# EAGLE design 523_jetson_jetbook (EAGLE 9.6.2)
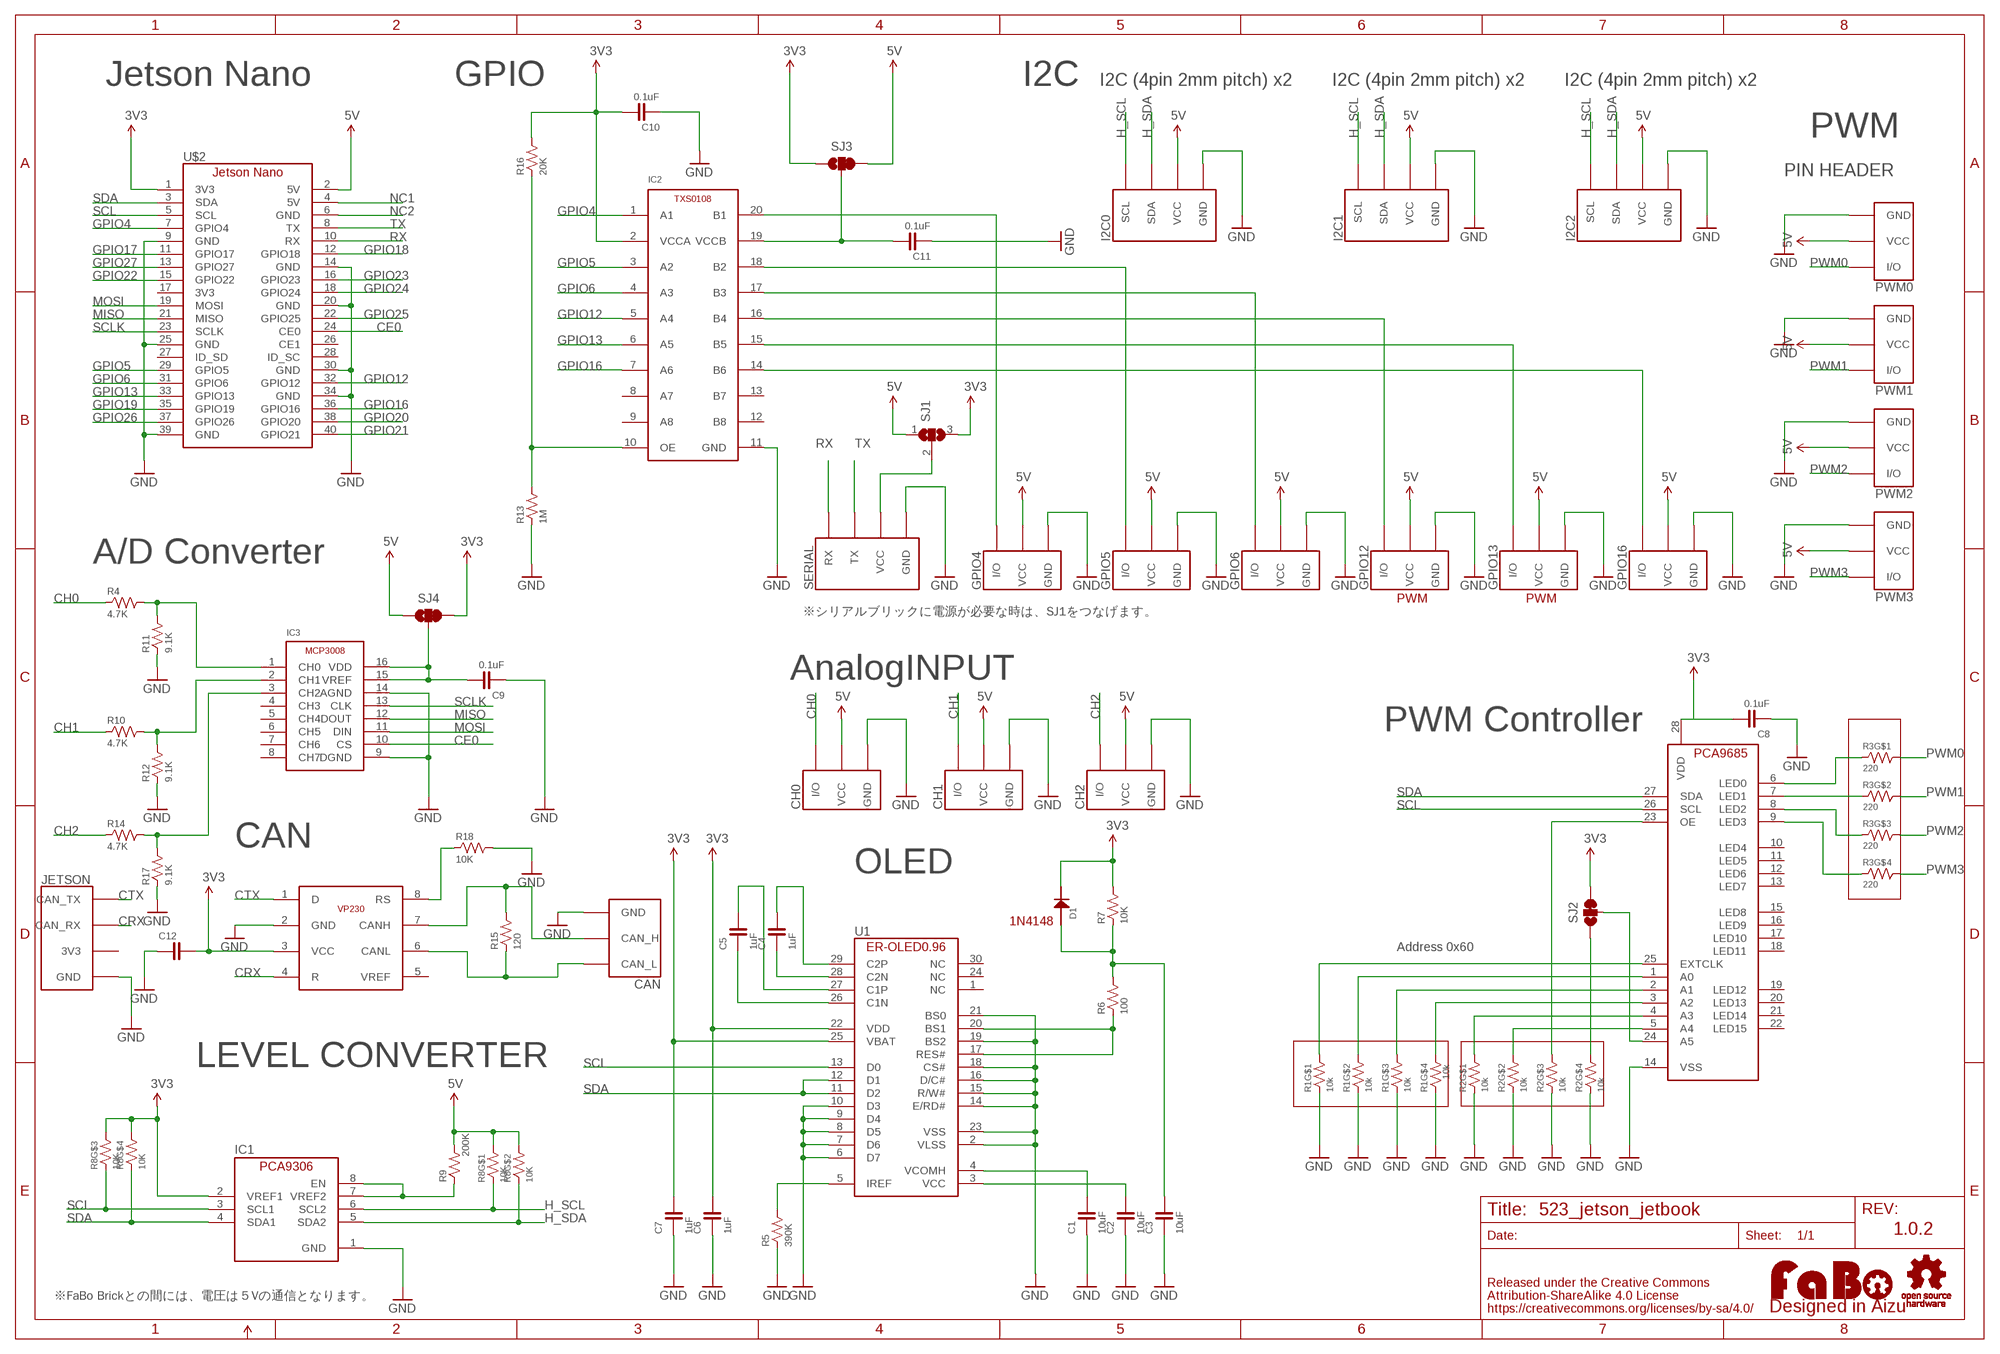
[diagram p0: schematic, sheet 1]

## Parts
C1  10uF  CAPACITOR-0603-BOTTOM  [0603-BOTTOM]
C2  10uF  CAPACITOR-0603-BOTTOM  [0603-BOTTOM]
C3  10uF  CAPACITOR-0603-BOTTOM  [0603-BOTTOM]
C4  1uF  CAPACITOR-0603-BOTTOM  [0603-BOTTOM]
C5  1uF  CAPACITOR-0603-BOTTOM  [0603-BOTTOM]
C6  1uF  CAPACITOR-0603-BOTTOM  [0603-BOTTOM]
C7  1uF  CAPACITOR-0603-BOTTOM  [0603-BOTTOM]
C8  0.1uF  CAPACITOR-0603  [0603]
C9  0.1uF  CAPACITOR-0603  [0603]
C10  0.1uF  CAPACITOR-0603  [0603]
C11  0.1uF  CAPACITOR-0603  [0603]
C12  CAPACITOR-0603  [0603]
CAN  FABO_BRICK_CAN  [FABO_BRICK_3PIN_B03B-PASK-1-CAN]
CH0  FABO_BRICK_3PIN-B03B-PASK-1  [FABO_BRICK_3PIN_B03B-PASK-1]
CH1  FABO_BRICK_3PIN-B03B-PASK-1  [FABO_BRICK_3PIN_B03B-PASK-1]
CH2  FABO_BRICK_3PIN-B03B-PASK-1  [FABO_BRICK_3PIN_B03B-PASK-1]
D1  1N4148  [1N4148W]
GPIO4  FABO_BRICK_3PIN-B03B-PASK-1  [FABO_BRICK_3PIN_B03B-PASK-1]
GPIO5  FABO_BRICK_3PIN-B03B-PASK-1  [FABO_BRICK_3PIN_B03B-PASK-1]
GPIO6  FABO_BRICK_3PIN-B03B-PASK-1  [FABO_BRICK_3PIN_B03B-PASK-1]
GPIO12  FABO_BRICK_3PIN-B03B-PASK-1  [FABO_BRICK_3PIN_B03B-PASK-1]
GPIO13  FABO_BRICK_3PIN-B03B-PASK-1  [FABO_BRICK_3PIN_B03B-PASK-1]
GPIO16  FABO_BRICK_3PIN-B03B-PASK-1  [FABO_BRICK_3PIN_B03B-PASK-1]
I2C0  FABO_BRICK_I2C-B04B-PASK-1  [FABO_BRICK_I2C_B04B-PASK-1]
I2C1  FABO_BRICK_I2C-B04B-PASK-1  [FABO_BRICK_I2C_B04B-PASK-1]
I2C2  FABO_BRICK_I2C-B04B-PASK-1  [FABO_BRICK_I2C_B04B-PASK-1]
IC1  PCA9306_SSOP  [8PIN-SSOP]
IC2  TXS0108  [R-PUSON-N20]
IC3  MICROCHIP-MCP3008  [MICROCHIP-MCP3008]
JETSON  FABO_BRICK_CAN_4P  [FABO_BRICK_CAN_B04B-PASL-1_BOTTOM]
LOGO1  LOGO_FABO-M  [LOGO_FABO_M]
PWM0  FABO_BRICK_3PIN-HEADER  [FABO_BRICK_3PIN_HEADER]
PWM1  FABO_BRICK_3PIN-HEADER  [FABO_BRICK_3PIN_HEADER]
PWM2  FABO_BRICK_3PIN-HEADER  [FABO_BRICK_3PIN_HEADER]
PWM3  FABO_BRICK_3PIN-HEADER  [FABO_BRICK_3PIN_HEADER]
R1  10k  RESISTOR_ARRAY  [EXBV8V]
R2  10k  RESISTOR_ARRAY  [EXBV8V]
R3  220  RESISTOR_ARRAY  [EXBV8V]
R4  4.7K  RESISTOR-0603-BOTTOM  [0603-BOTTOM]
R5  390K  RESISTOR-0603-BOTTOM  [0603-BOTTOM]
R6  100  RESISTOR-0603-BOTTOM  [0603-BOTTOM]
R7  10K  RESISTOR-0603-BOTTOM  [0603-BOTTOM]
R8  10K  RESISTOR_ARRAY  [EXBV8V]
R9  200K  RESISTOR-0603  [0603]
R10  4.7K  RESISTOR-0603-BOTTOM  [0603-BOTTOM]
R11  9.1K  RESISTOR-0603-BOTTOM  [0603-BOTTOM]
R12  9.1K  RESISTOR-0603-BOTTOM  [0603-BOTTOM]
R13  1M  RESISTOR-0603-BOTTOM  [0603-BOTTOM]
R14  4.7K  RESISTOR-0603-BOTTOM  [0603-BOTTOM]
R15  120  RESISTOR-0603  [0603]
R16  20K  RESISTOR-0603-BOTTOM  [0603-BOTTOM]
R17  9.1K  RESISTOR-0603-BOTTOM  [0603-BOTTOM]
R18  10K  RESISTOR-0603  [0603]
SERIAL  FABO_BRICK_SERIAL-B04B-PASK-1  [FABO_BRICK_SERIAL_B04B-PASK-1]
SJ1  SJ2W  [SJ_2]
SJ2  SMD-JUMPER-3-23SHORT  [SMD-JUMPER-3]
SJ3  SMD-JUMPER-3-23SHORT  [SMD-JUMPER-3]
SJ4  SMD-JUMPER-3-23SHORT  [SMD-JUMPER-3]
U1  ER-OLED0.96-1ER-CON30HT-1  [ER-CON30HT-1]
U$2  JETSON_NANO_NORBORDER_BOTTOM  [JETSON_NANO_NOBOARDER_BOTTOM]
U$7  LOGO_OSHW-M_BOTTOM  [LOGO_OSHW_M_BOTTOM]
U$8  SN65HVD230  [SN65HVD230]
U$9  PCA9685  [PCA9685]

## Nets
3V3: C6.2 C7.2 C8.2 C10.2 C12.2 D1.CATHODE IC1.2(VREF1) IC2.2(VCCA) R7.2 R8.5 R8.6 R16.2 SJ1.3 SJ2.3 SJ3.1 SJ4.3 U1.22(VDD) U1.25(VBAT) U$2.1(3V3) U$8.3(VCC) U$9.28(VDD)
5V: CH0.VCC CH1.VCC CH2.VCC GPIO4.VCC GPIO5.VCC GPIO6.VCC GPIO12.VCC GPIO13.VCC GPIO16.VCC I2C0.VCC I2C1.VCC I2C2.VCC PWM0.VCC PWM1.VCC PWM2.VCC PWM3.VCC R8.7 R8.8 R9.2 SJ1.1 SJ3.3 SJ4.1 U$2.2(5V)
CE0: IC3.10(CS) U$2.24(CE0)
CH0: CH0.I/O R4.1
CH1: CH1.I/O R10.1
CH2: CH2.I/O R14.1
CRX: JETSON.CAN_RX U$8.4(R)
CTX: JETSON.CAN_TX U$8.1(D)
GND: C1.1 C2.1 C3.1 C6.1 C7.1 C8.1 C9.1 C10.1 C11.1 C12.1 CAN.GND CH0.GND CH1.GND CH2.GND GPIO4.GND GPIO5.GND GPIO6.GND GPIO12.GND GPIO13.GND GPIO16.GND I2C0.GND I2C1.GND I2C2.GND IC1.1(GND) IC2.11(GND) IC3.9(DGND) IC3.14(AGND) JETSON.GND PWM0.GND PWM1.GND PWM2.GND PWM3.GND R1.1 R1.2 R1.3 R1.4 R2.1 R2.2 R2.3 R2.4 R5.1 R11.1 R12.1 R13.1 R17.1 R18.2 SERIAL.GND U1.2(VLSS) U1.6(D7) U1.7(D6) U1.8(D5) U1.9(D4) U1.10(D3) U1.14(E/RD#) U1.15(R/W#) U1.16(D/C#) U1.18(CS#) U1.19(BS2) U1.21(BS0) U1.23(VSS) U$2.9(GND) U$2.14(GND) U$2.20(GND) U$2.25(GND) U$2.30(GND) U$2.34(GND) U$2.39(GND) U$8.2(GND) U$9.14(VSS)
GPIO4: IC2.1(A1) U$2.7(GPIO4)
GPIO5: IC2.3(A2) U$2.29(GPIO5)
GPIO6: IC2.4(A3) U$2.31(GPIO6)
GPIO12: IC2.5(A4) U$2.32(GPIO12)
GPIO13: IC2.6(A5) U$2.33(GPIO13)
GPIO16: IC2.7(A6) U$2.36(GPIO16)
GPIO17: U$2.11(GPIO17)
GPIO18: U$2.12(GPIO18)
GPIO19: U$2.35(GPIO19)
GPIO20: U$2.38(GPIO20)
GPIO21: U$2.40(GPIO21)
GPIO22: U$2.15(GPIO22)
GPIO23: U$2.16(GPIO23)
GPIO24: U$2.18(GPIO24)
GPIO25: U$2.22(GPIO25)
GPIO26: U$2.37(GPIO26)
GPIO27: U$2.13(GPIO27)
H_SCL: I2C0.SCL I2C1.SCL I2C2.SCL IC1.6(SCL2) R8.1
H_SDA: I2C0.SDA I2C1.SDA I2C2.SDA IC1.5(SDA2) R8.2
MISO: IC3.12(DOUT) U$2.21(MISO)
MOSI: IC3.11(DIN) U$2.19(MOSI)
N$2: R3.1 U$9.6(LED0)
N$3: R3.2 U$9.7(LED1)
N$4: R1.7 U$9.1(A0)
N$5: R3.3 U$9.8(LED2)
N$6: R3.4 U$9.9(LED3)
N$7: R2.6 U$9.23(OE)
N$8: R1.8 U$9.25(EXTCLK)
N$9: GPIO4.I/O IC2.20(B1)
N$10: R1.6 U$9.2(A1)
N$11: R1.5 U$9.3(A2)
N$12: R2.8 U$9.4(A3)
N$13: R2.7 U$9.5(A4)
N$14: C5.2 U1.27(C1P)
N$15: GPIO5.I/O IC2.18(B2)
N$16: C5.1 U1.26(C1N)
N$17: GPIO6.I/O IC2.17(B3)
N$18: GPIO12.I/O IC2.16(B4)
N$19: C4.1 U1.28(C2N)
N$20: GPIO13.I/O IC2.15(B5)
N$21: C4.2 U1.29(C2P)
N$22: GPIO16.I/O IC2.14(B6)
N$23: R5.2 U1.5(IREF)
N$24: C1.2 U1.4(VCOMH)
N$25: C2.2 U1.3(VCC)
N$26: R6.1 U1.17(RES#) U1.20(BS1)
N$27: C3.2 D1.ANODE R6.2 R7.1
N$28: IC2.10(OE) R13.2 R16.1
N$29: C11.2 IC2.19(VCCB) SJ3.2
N$30: SERIAL.VCC SJ1.2
N$31: IC3.3(CH2) R14.2 R17.2
N$32: SJ2.2 U$9.24(A5)
N$33: IC1.7(VREF2) IC1.8(EN) R9.1
N$34: IC3.1(CH0) R4.2 R11.2
N$35: R2.5 SJ2.1
N$36: IC3.2(CH1) R10.2 R12.2
N$37: C9.2 IC3.15(VREF) IC3.16(VDD) SJ4.2
N$38: CAN.CAN_H R15.2 U$8.7(CANH)
N$39: CAN.CAN_L R15.1 U$8.6(CANL)
N$40: R18.1 U$8.8(RS)
NC1: U$2.4(5V)
NC2: U$2.6(GND)
PWM0: PWM0.I/O R3.8
PWM1: PWM1.I/O R3.7
PWM2: PWM2.I/O R3.6
PWM3: PWM3.I/O R3.5
RX: SERIAL.RX U$2.10(RX)
SCL: IC1.3(SCL1) R8.3 U1.13(D0) U$2.5(SCL) U$9.26(SCL)
SCLK: IC3.13(CLK) U$2.23(SCLK)
SDA: IC1.4(SDA1) R8.4 U1.11(D2) U1.12(D1) U$2.3(SDA) U$9.27(SDA)
TX: SERIAL.TX U$2.8(TX)
Unconnected: IC2.8(A7) IC2.9(A8) IC2.12(B8) IC2.13(B7) IC3.4(CH3) IC3.5(CH4) IC3.6(CH5) IC3.7(CH6) IC3.8(CH7) JETSON.VCC(3V3) U1.1(NC) U1.24(NC) U1.30(NC) U$2.17(3V3) U$2.26(CE1) U$2.27(ID_SD) U$2.28(ID_SC) U$8.5(VREF) U$9.10(LED4) U$9.11(LED5) U$9.12(LED6) U$9.13(LED7) U$9.15(LED8) U$9.16(LED9) U$9.17(LED10) U$9.18(LED11) U$9.19(LED12) U$9.20(LED13) U$9.21(LED14) U$9.22(LED15)

## Notes on the sheet
- Jetson Nano | GPIO | I2C | I2C (4pin 2mm pitch) x2 | I2C (4pin 2mm pitch) x2 | I2C (4pin 2mm pitch) x2
- PWM
- PIN HEADER
- A/D Converter
- PWM | PWM
- ※シリアルブリックに電源が必要な時は、SJ1をつなげます。
- AnalogINPUT
- PWM Controller
- CAN
- OLED
- 1N4148
- Address 0x60
- LEVEL CONVERTER
- 1.0.2
- ※FaBo Brickとの間には、電圧は５Vの通信となります。

## Library data of the parts
C1-C12 = FaBo-Capacitor:CAPACITOR: CAPACITOR
CAN = FaBo-Template:FABO_BRICK_CAN
CH0 CH1 CH2 GPIO4-GPIO6 GPIO12 GPIO13 GPIO16 PWM0 PWM1-PWM3 = FaBo-Template:FABO_BRICK_3PIN: FaBo Brick 3pin
D1 = FaBo-Diode:1N4148
I2C0 I2C1 I2C2 = FaBo-Template:FABO_BRICK_I2C: FaBo Brick I2C
IC1 = FaBo-LevelTranslator:PCA9306
IC2 = FaBo-LevelTranslator:TXS0108
IC3 = FaBo-ADC:MICROCHIP-MCP3008
JETSON = FaBo-Template:FABO_BRICK_CAN_4P
LOGO1 = component:LOGO_FABO
R1-R3 R8 = component:RESISTOR_ARRAY
R4-R7 R9-R18 = FaBo-Resistors:RESISTOR: RESISTOR
SERIAL = FaBo-Template:FABO_BRICK_SERIAL: FaBo Brick Serial
SJ1 = jumper:SJ2W: SMD solder JUMPER
SJ2-SJ4 = FaBo-etc:SMD-JUMPER-3-23SHORT
U1 = FaBo-Display:ER-OLED0.96-1
U$2 = FaBo-Boards:JETSON_NANO
U$7 = component:LOGO_OSHW
U$8 = FaBo-CAN:SN65HVD230
U$9 = FaBo-Motor:PCA9685

## Board
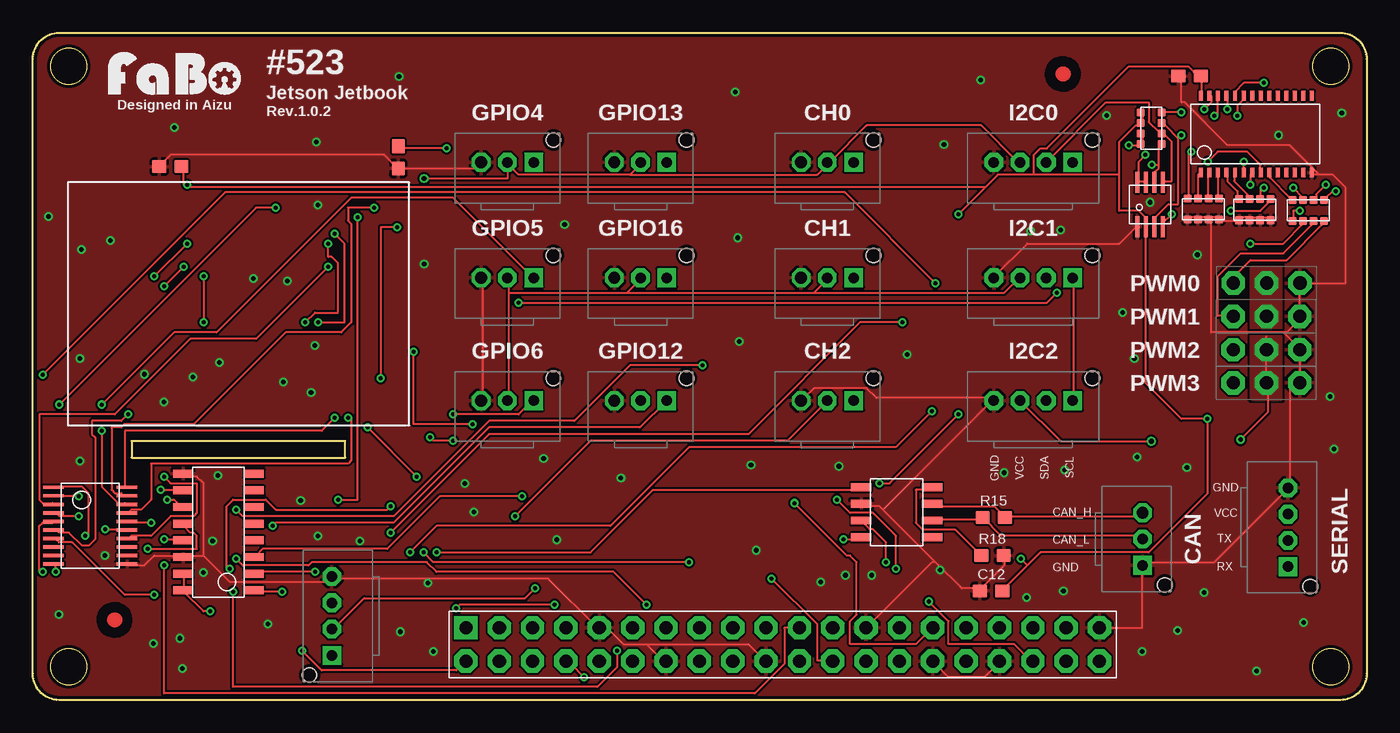
[diagram p1: board, top side]
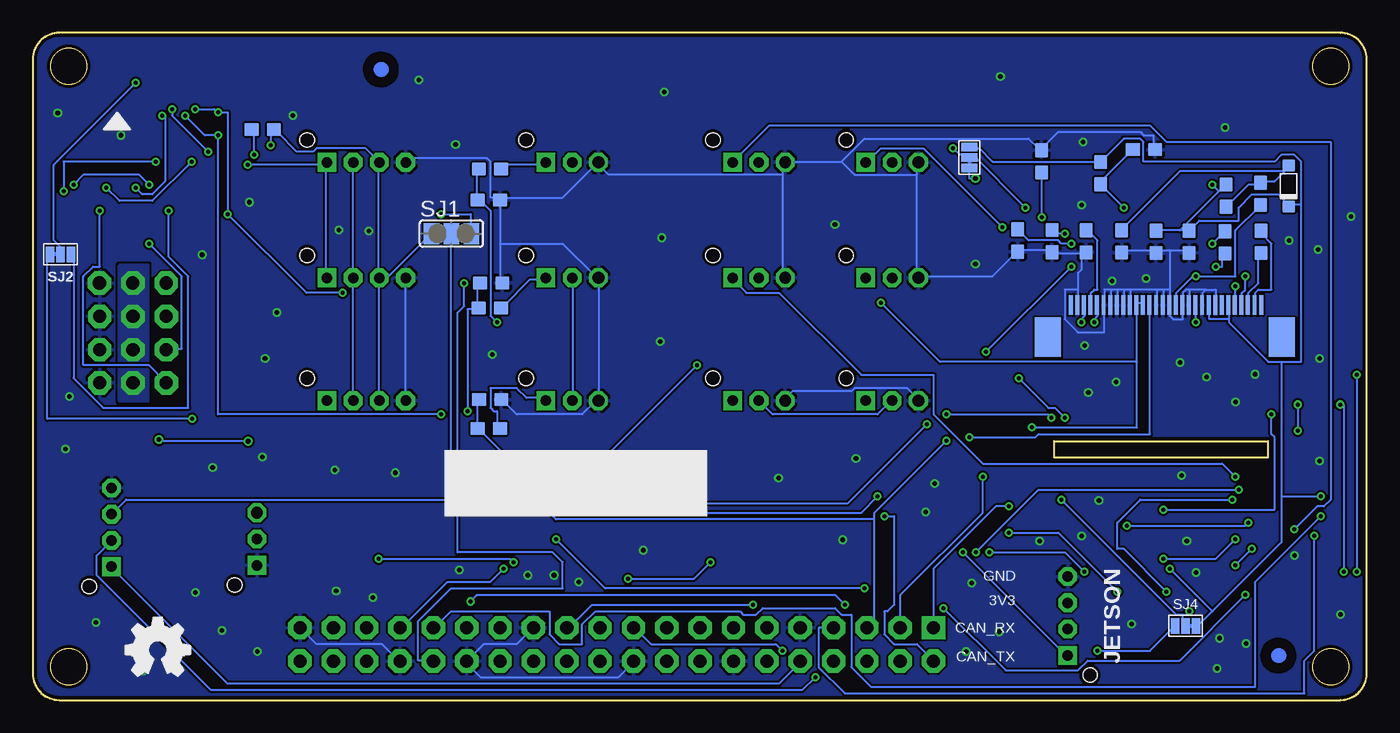
[diagram p2: board, bottom side, seen from below]

Size 101.6 x 50.8 mm. Coordinates in mm from the lower left corner, seen from the top.
Outline: 7.52,18.45 23.8,18.45 23.8,19.72 7.52,19.72 7.52,18.45
Outline: 101.6,48.8 101.6,2 arc-90 99.6,0 2,0 arc-90 0,2 0,48.8 arc-90 2,50.8 99.6,50.8 arc-90 101.6,48.8
Outline: circle at 2.75,48.26 radius 1.38
Outline: circle at 2.75,2.54 radius 1.38
Outline: circle at 98.85,2.54 radius 1.38
Outline: circle at 98.85,48.26 radius 1.38
Copper layers (1*16): Top 0.035mm / dielectric 1.6mm / Bottom 0.035mm
Design rules "PCBway": minimum track width 6mil, minimum drill 12mil, track to track 6mil, track to pad 6mil, pad to pad 6mil, via to via 6mil, smd to smd 6mil, copper to edge 10mil, drill to drill 10mil, minimum pad ring 10mil, minimum via ring 6mil, stop-mask expansion 2mil, vias tented up to drill 100mil, thermal gap 8mil
bRestrict: 7 lines

### Footprints (pad centres in the part's own frame; a part is rotated, then mirrored left to right if it is on the bottom)
0603-BOTTOM = smd 1.1 x 1 bottom: 1 -0.85,0; 2 0.85,0
0603 = smd 1.1 x 1: 1 -0.85,0; 2 0.85,0
FABO_BRICK_3PIN_B03B-PASK-1-CAN = drill 0.9 pad 1.422 octagon: CAN_H -2,0 | drill 0.8 pad 1.422 octagon: CAN_L 0,0 | drill 0.8 pad 1.422 square: GND 2,0 | hole 1.1: 3.5,1.7
FABO_BRICK_3PIN_B03B-PASK-1 = drill 0.9 pad 1.422 octagon: GND -2,0 | drill 0.8 pad 1.422 square: I/O 2,0 | drill 0.8 pad 1.422 octagon: VCC 0,0 | hole 1.1: 3.5,1.7
1N4148W = smd 0.9 x 0.95: ANODE 0,0; CATHODE 3.15,0
FABO_BRICK_I2C_B04B-PASK-1 = drill 0.8 pad 1.422 octagon: GND -3,0; SDA 1,0; VCC -1,0 | drill 0.8 pad 1.422 square: SCL 3,0 | hole 1.1: 4.5,1.7
8PIN-SSOP = smd 0.3 x 1.6: 1 -0.975,-1.7; 2 -0.325,-1.7; 3 0.325,-1.7; 4 0.975,-1.7; 5 0.975,1.7; 6 0.325,1.7; 7 -0.325,1.7; 8 -0.975,1.7
R-PUSON-N20 = smd 0.25 x 1.55: 1 -2.925,-2.8; 2 -2.275,-2.8; 3 -1.625,-2.8; 4 -0.975,-2.8; 5 -0.325,-2.8; 6 0.325,-2.8; 7 0.975,-2.8; 8 1.625,-2.8; 9 2.275,-2.8; 10 2.925,-2.8; 11 2.925,2.8; 12 2.275,2.8; 13 1.625,2.8; 14 0.975,2.8; 15 0.325,2.8; 16 -0.325,2.8; 17 -0.975,2.8; 18 -1.625,2.8; 19 -2.275,2.8; 20 -2.925,2.8
MICROCHIP-MCP3008 = smd 0.6 x 1.5: 1 -4.445,-2.7; 2 -3.175,-2.7; 3 -1.905,-2.7; 4 -0.635,-2.7; 5 0.635,-2.7; 6 1.905,-2.7; 7 3.175,-2.7; 8 4.445,-2.7; 9 4.445,2.7; 10 3.175,2.7; 11 1.905,2.7; 12 0.635,2.7; 13 -0.635,2.7; 14 -1.905,2.7; 15 -3.175,2.7; 16 -4.445,2.7
FABO_BRICK_CAN_B04B-PASL-1_BOTTOM = drill 0.8 pad 1.422 octagon: CAN_RX -1,0.025; GND 3,0.025; VCC 1,0.025 | drill 0.8 pad 1.422 square: CAN_TX -3,0.025 | hole 1.1: -4.5,1.725
FABO_BRICK_3PIN_HEADER = drill 1 pad 1.778 octagon: GND -2.54,0; I/O 2.54,0; VCC 0,0
EXBV8V = smd 0.6 x 0.6: 1 -1.2,-0.8; 2 -0.4,-0.8; 3 0.4,-0.8; 4 1.2,-0.8; 5 1.2,0.8; 6 0.4,0.8; 7 -0.4,0.8; 8 -1.2,0.8
FABO_BRICK_SERIAL_B04B-PASK-1 = drill 0.8 pad 1.422 octagon: GND -3,0; TX 1,0; VCC -1,0 | drill 0.8 pad 1.422 square: RX 3,0 | hole 1.1: 4.5,1.7
SJ_2 = smd 1.168 x 1.6: 1 -1.524,0; 2 0,0; 3 1.524,0
SMD-JUMPER-3 = smd 0.64 x 1.2: 1 -0.8,0; 2 0,0; 3 0.8,0
ER-CON30HT-1 = smd 0.3 x 1.5 bottom: 1 7,-0.23; 2 6.5,-0.23; 3 6,-0.23; 4 5.5,-0.23; 5 5,-0.23; 6 4.5,-0.23; 7 4,-0.23; 8 3.5,-0.23; 9 3,-0.23; 10 2.5,-0.23; 11 2,-0.23; 12 1.5,-0.23; 13 1,-0.23; 14 0.5,-0.23; 15 0,-0.23; 16 -0.5,-0.23; 17 -1,-0.23; 18 -1.5,-0.23; 19 -2,-0.23; 20 -2.5,-0.23; 21 -3,-0.23; 22 -3.5,-0.23; 23 -4,-0.23; 24 -4.5,-0.23; 25 -5,-0.23; 26 -5.5,-0.23; 27 -6,-0.23; 28 -6.5,-0.23; 29 -7,-0.23; 30 -7.5,-0.23 | smd 2 x 3 bottom: 31 -9.07,-2.67; 32 8.74,-2.67
JETSON_NANO_NOBOARDER_BOTTOM = drill 1 pad 1.778 square: 1 -25.4,1.27 | drill 1 pad 1.778 octagon: 2 -25.4,-1.27; 3 -22.86,1.27; 4 -22.86,-1.27; 5 -20.32,1.27; 6 -20.32,-1.27; 7 -17.78,1.27; 8 -17.78,-1.27; 9 -15.24,1.27; 10 -15.24,-1.27; 11 -12.7,1.27; 12 -12.7,-1.27; 13 -10.16,1.27; 14 -10.16,-1.27; 15 -7.62,1.27; 16 -7.62,-1.27; 17 -5.08,1.27; 18 -5.08,-1.27; 19 -2.54,1.27; 20 -2.54,-1.27; 21 0,1.27; 22 0,-1.27; 23 2.54,1.27; 24 2.54,-1.27; 25 5.08,1.27; 26 5.08,-1.27; 27 7.62,1.27; 28 7.62,-1.27; 29 10.16,1.27; 30 10.16,-1.27; 31 12.7,1.27; 32 12.7,-1.27; 33 15.24,1.27; 34 15.24,-1.27; 35 17.78,1.27; 36 17.78,-1.27; 37 20.32,1.27; 38 20.32,-1.27; 39 22.86,1.27; 40 22.86,-1.27
SN65HVD230 = smd 1.55 x 0.6: 1 -2.7,1.905; 2 -2.7,0.635; 3 -2.7,-0.635; 4 -2.7,-1.905; 5 2.7,-1.905; 6 2.7,-0.635; 7 2.7,0.635; 8 2.7,1.905
PCA9685 = smd 0.3 x 0.75: 1 -4.15,-2.93; 2 -3.5,-2.93; 3 -2.85,-2.93; 4 -2.2,-2.93; 5 -1.55,-2.93; 6 -0.9,-2.93; 7 -0.25,-2.93; 8 0.4,-2.93; 9 1.05,-2.93; 10 1.7,-2.93; 11 2.35,-2.93; 12 3,-2.93; 13 3.65,-2.93; 14 4.3,-2.93; 15 4.3,2.92; 16 3.65,2.92; 17 3,2.92; 18 2.35,2.92; 19 1.7,2.92; 20 1.05,2.92; 21 0.4,2.92; 22 -0.25,2.92; 23 -0.9,2.92; 24 -1.55,2.92; 25 -2.2,2.92; 26 -2.85,2.92; 27 -3.5,2.92; 28 -4.15,2.92

### Placement (x,y rotation side)
C1  21.38,34.93 90 top
C2  23.96,34.94 90 top
C3  18.65,34.92 90 top
C4  8.03,34.88 90 top
C5  10.78,34.85 90 top
C6  16.05,34.88 90 top
C7  13.52,34.89 90 top
C8  88.11,47.49 0 top
C9  24.77,41.01 270 bottom
C10  10.47,40.61 0 top
C11  27.83,41.32 90 top
C12  73,8.3 0 top
CAN  84.53,12.26 270 top
CH0  60.52,40.94 0 top
CH1  60.52,32.15 0 top
CH2  60.52,22.79 0 top
D1  5.94,40.71 270 bottom
GPIO4  36.15,40.94 0 top
GPIO5  36.15,32.15 0 top
GPIO6  36.15,22.79 0 top
GPIO12  46.29,22.79 0 top
GPIO13  46.29,40.94 0 top
GPIO16  46.29,32.15 0 top
I2C0  76.2,40.94 0 top
I2C1  76.2,32.15 0 top
I2C2  76.2,22.79 0 top
IC1  85.09,37.73 0 top
IC2  4.38,13.27 270 top
IC3  14.14,12.79 90 top
JETSON  22.8,6.4 90 top
LOGO1  10.79,45.72 0 top
PWM0  93.98,31.75 180 top
PWM1  93.97,29.21 180 top
PWM2  93.97,26.67 180 top
PWM3  93.97,24.15 180 top
R1  89.15,37.37 0 top
R2  93.09,37.33 0 top
R3  97.15,37.28 180 top
R4  66.78,40.42 0 top
R5  26.58,34.99 90 top
R6  8.09,38.54 90 top
R7  10.7,38.4 90 top
R8  85.19,43.53 90 top
R9  84.09,43.43 0 bottom
R10  66.79,29.86 0 top
R11  66.87,38.08 0 top
R12  66.69,31.76 0 top
R13  16.97,41.91 0 top
R14  66.87,20.67 0 top
R15  73.2,13.9 0 top
R16  20.27,40.11 90 top
R17  66.77,22.87 0 top
R18  73.1,11 0 top
SERIAL  95.6,13.15 270 top
SJ1  69.72,35.52 0 bottom
SJ2  99.49,33.93 180 bottom
SJ3  30.27,41.31 270 bottom
SJ4  13.79,5.64 0 bottom
U1  15.54,30.3 0 top
U$2  58.39,4.23 0 top
U$3  [MARK_POINT_3MM]  6.24,6.1 0 top
U$4  [MARK_POINT_3MM]  78.48,47.67 0 top
U$5  [MARK_POINT_3MM]  6.7,3.38 0 bottom
U$6  [MARK_POINT_3MM]  75.06,48.01 0 bottom
U$7  92.08,3.81 0 top
U$8  65.8,14.3 0 top
U$9  93.12,43.09 0 top

### Tracks (layer width: path | path; a pad name or v marks a point on that pad's centre or on a via)
3V3  (via drill 0.3)
  Top 0.152: C10.2 11.5,40.5 11.5,39.25 v11.75,39.25 11.95,39.05 72.55,39.05 | v3.5,15.5 1.75,15.5 IC2.2 | v27.25,14.75 27,14.5 18.5,14.5 17.75,15.25 15.25,15.25 14.75,14.75 14.75,10 v15,10 | U$9.28 89,46.25 89,47.25 C8.2 88.75,47.5 88,48.25 83.5,48.25 77.25,42 76.75,42 76.25,41.5 76.25,40 | R8.5 84.5,44.5 84.5,44 R8.6 84.25,43.75 84,43.75 82.75,42.5 82.75,40 | 82.75,40 82.75,37.25 84.25,37.25 84.75,36.75 84.75,36.25 IC1.2 84.75,36 84.75,24.15 87.5,21.4 v89.45,21.4 89.45,15.7 85,11.25 76.75,11.25 75.75,10.25 | 75.75,10.25 74,8.5 C12.2 | 82.75,40 76.25,40 | v65,10.5 65,12 64,13 63.75,13 63.25,13.5 U$8.3 | 75.75,10.25 v75.25,10.75 | 72.55,39.05 73.5,40 76.25,40 | 72.55,39.05 v70.5,37
  Bottom 0.152: SJ3.1 30.25,42 29.5,42 28.5,41 20.5,41 R16.2 20.25,41 18.5,42.75 17.25,42.75 17,42.5 17,41 7,41 6.5,41.5 5.5,41.5 5,41 5,37.75 | 14.25,35.75 13.75,35.75 C7.2 13.5,35.75 12.75,36.5 9.75,36.5 9.75,37.5 8.75,38.5 6.75,38.5 6,37.75 D1.CATHODE 5.75,37.75 5,37.75 | 14.25,35.75 16,35.75 C6.2 | 14.25,35.75 11.25,38.75 | 11.25,38.75 10.75,39.25 R7.2 | 11.25,38.75 v11.75,39.25 | 11.75,6.75 6.5,12 6.5,15.5 | 11.75,6.75 12.75,5.75 SJ4.3 | 6.5,25.75 6.5,15.5 | 6.5,25.75 7.5,25.75 10.5,28.75 10.5,29 | 10.5,29 10.5,30 U1.25 | 10.5,29 12,29 12,30 U1.22 | 6.5,15.5 v3.5,15.5 | v27.25,14.75 28.25,14.75 33,10 U$2.1 | 11.75,6.75 v15,10 | 5,37.75 5,25.75 6.5,25.75 | v89.45,21.4 100.5,21.4 100.5,33.75 SJ2.3 | v65,10.5 65.25,10.75 v75.25,10.75 | v70.5,37 68.25,37 68.25,35.75 SJ1.3
5V  (via drill 0.3, 0.35)
  Top 0.152: 45.5,40 37,40 36.25,40.75 GPIO4.VCC 36.15,39.7 v29.8,39.7 | 45.5,40 46.25,40.75 GPIO13.VCC | 45.5,40 59.75,40 60.5,40.75 CH0.VCC 60.75,41 63.5,43.75 72.25,43.75 75,41 I2C0.VCC | R8.7 84.5,43 84.5,42.5 R8.8 84.25,42.25 v83.5,42.25 | 91.89,19.73 v91.98,19.82 94.09,21.93 94.09,24.03 PWM3.VCC PWM2.VCC 93.97,26.9 | 75.25,22.75 I2C2.VCC 78.29,19.7 v85.2,19.7 | v20.5,3.75 22,2.25 32.25,2.25 32.75,2.75 U$2.2 | 36.25,31 36.25,32 GPIO5.VCC | 36.25,31 36.25,23 GPIO6.VCC | 45.25,31 46.25,32 GPIO16.VCC | 36.25,31 45.25,31 | 59.5,31 60.5,32 CH1.VCC | 45.25,31 59.5,31 | v36.75,14 42.5,19.75 57.5,19.75 60.5,22.75 CH2.VCC | 59.5,31 74,31 75,32 I2C1.VCC | 93.97,26.9 93.97,27.7 | 94.09,26.78 93.97,26.9
  Bottom 0.152: v83.5,42.25 83.5,43.25 83.25,43.25 R9.2 83,43.25 81.5,41.75 80.25,41.75 80,42 76.25,42 75.25,41 I2C0.VCC 75.25,40.75 75.25,32.25 I2C1.VCC | SJ1.1 71.25,35.5 74.5,32.25 75,32.25 I2C1.VCC | I2C2.VCC 75.25,23 75.25,32 I2C1.VCC | v20.5,3.75 16.5,3.75 14.75,5.5 SJ4.1 | CH2.VCC 60.5,23 60.5,32 CH1.VCC | GPIO12.VCC 45.25,21.75 37.25,21.75 36.25,22.75 GPIO6.VCC | v36.75,14 36,14 36,7.25 36.5,6.75 36.75,6.75 36.75,5 36,4.25 34.25,4.25 33,3 U$2.2 | v29.8,39.7 30.27,39.7 SJ3.3 | v91.98,19.82 91.86,19.7 v85.2,19.7
  pour Top (no thermals): 92.89,33.03 95.09,33.03 95.09,22.83 92.89,22.83 92.79,22.93 92.79,32.93
  pour Bottom (no thermals): 92.79,33.13 94.99,33.13 95.09,33.03 95.09,22.83 94.99,22.73 92.79,22.73
CE0  (via drill 0.3)
  Top 0.152: v9.75,16 11.25,16 IC3.10 | v29.75,11.25 30.5,10.5 v50,10.5 | v56.25,9.25 59.75,5.75 59.75,3 60.75,3 U$2.24
  Bottom 0.152: v9.75,16 25,16 v29.75,11.25 | v50,10.5 51.25,9.25 v56.25,9.25
CH0
  Bottom 0.152: R4.1 65.75,40.5 65.5,40.75 62.75,40.75 CH0.I/O
CH1
  Bottom 0.152: R10.1 65.75,30 63.75,32 62.75,32 CH1.I/O
CH2
  Bottom 0.152: R14.1 66.25,20.75 66.25,22 66.5,22 66.75,22.25 66.75,23.75 64.75,23.75 64,23 62.75,23 CH2.I/O
CRX  (via drill 0.3)
  Top 0.152: v61.75,12.25 63,12.25 U$8.4 | v38.25,8.5 37.5,7.75 25.25,7.75 23,5.5 JETSON.CAN_RX
  Bottom 0.152: v61.75,12.25 58,8.5 v38.25,8.5
CTX  (via drill 0.3)
  Top 0.152: v30.75,11.25 42.5,11.25 47.25,16 63,16 U$8.1
  Bottom 0.152: v30.75,11.25 23,3.5 JETSON.CAN_TX
GND  (via drill 0.35)
  Top 0.152: C10.1 9.75,40.75 10.5,41.5 26.75,41.5 27.75,40.5 C11.1 28,40.5 33.75,40.5 34,40.75 GPIO4.GND | GPIO6.GND 34.25,23 34.25,32 GPIO5.GND | 98,40 99,40 100,39 100,31.75 PWM0.GND 96.5,31.75 96.5,29.25 PWM1.GND 96.5,29 95.5,28 95.25,28 | 98,40 97.5,40 U$9.14 | 98,40 95.75,42.25 91,42.25 87.75,45.5 87.5,45.5 87.5,47.25 C8.1 | R2.4 94.25,36.75 93.5,36.75 R2.3 93.25,36.75 92.75,36.75 R2.2 92.5,36.75 92,36.75 R2.1 91.75,36.5 90.5,36.5 R1.4 90.25,36.75 89.75,36.75 R1.3 | R1.1 88,36.75 88.5,36.75 R1.2 88.75,36.75 89.5,36.75 R1.3 | 95.25,28 89.75,28 89.75,36.5 R1.3 | 95.25,28 96.5,26.75 PWM2.GND 96.5,26.5 96.5,24.25 PWM3.GND 96.5,24 95.75,24 95.75,16.25 SERIAL.GND 95.5,16 90,10.5 84.75,10.5 CAN.GND 84.5,10.25 84.5,5.5 U$2.39 | IC1.1 84,36 82.75,34.75 75.75,34.75 73.25,32.25 I2C1.GND | IC2.11 7.25,10.25 8.5,10.25 9.25,11 11.25,11 IC3.14 11.5,11 13,11 | 13,11 13,16.5 12.5,17 11.5,17 IC3.9 | 13,11 15,9 22.5,9 22.75,9.25 JETSON.GND 23,9.25 39.25,9.25 43,5.5 U$2.9 43.75,5.5 45,4.25 46.75,4.25 | 46.75,4.25 48,3 U$2.14 | 46.75,4.25 54.5,4.25 55.75,3 U$2.20 | U$2.30 68.75,2.75 69.75,1.75 72.5,1.75 73.5,2.75 U$2.34 | R18.2 74,11 74,10.25 72.25,8.5 C12.1 72,8.5 70.75,8.5 68.75,10.5 | 68.75,10.5 64.75,14.5 | 64.75,14.5 64.5,14.75 63.25,14.75 U$8.2 | 68.75,10.5 68.5,10.5 63.5,5.5 U$2.25 | 64.75,14.5 73,22.75 I2C2.GND 73,23 64.25,23 63.5,23.75 59.5,23.75 58.75,23 CH2.GND
  Bottom 0.152: 12.25,31.25 11.5,31.25 11.5,30.25 U1.23 | 12.25,31.25 12.5,31 12.5,30.25 U1.21 | 13.5,31.25 13.5,30.25 U1.19 | 12.25,31.25 13.5,31.25 | 13.5,31.25 13.75,31.25 14,31 14,30.25 U1.18 14,30 14,29 14.75,29 15,29.25 15,30 U1.16 15,30.25 15,31.25 | C3.1 18.5,34.25 16.25,34.25 C6.1 16,34.25 15,34.25 | 15,34.25 13.75,34.25 C7.1 | 15,34.25 15,31.25 | 15.5,31.25 15.5,30.25 U1.15 | 15,31.25 15.5,31.25 | 16,31.25 16,30.25 U1.14 | 15.5,31.25 16,31.25 | 18,31.25 18,30.25 U1.10 | 16,31.25 18,31.25 | 18.5,31.25 18.5,30.25 U1.9 | 18,31.25 18.5,31.25 | 19,31.25 19,30.25 U1.8 | 18.5,31.25 19,31.25 | 19.5,31.25 19.5,30.25 U1.7 | 19,31.25 19.5,31.25 | 19.5,31.25 20,31.25 20,30.25 U1.6 20,30 20,28 22,28 23,29 23,31.25 22,31.25 | 21.75,34 23.75,34 C2.1 24,34.25 26.5,34.25 R5.1 26.75,34 28.5,32.25 34,32.25 GPIO5.GND 34.25,32.25 34.25,40 | 21.75,34 21.5,34 C1.1 21.75,34 | 22,31.25 22,32.5 21.75,32.75 21.75,34 | 22,31.25 22,30.25 U1.2 | GPIO12.GND 44.25,23 43.75,23.5 39.25,23.5 39,23.75 35,23.75 34.25,23 GPIO6.GND | 34.25,40 34.25,40.75 GPIO4.GND | R17.1 65.75,22.75 64.75,21.75 59.75,21.75 58.75,22.75 CH2.GND 58.5,23 58.5,32 CH1.GND 58.75,32.25 61.25,34.75 66,34.75 | 66,34.75 66,38 R11.1 | 66,34.75 66,32 R12.1 | R11.1 66,38.25 61.25,38.25 58.75,40.75 CH0.GND 58.5,40.75 57.75,40 44.5,40 | I2C0.GND 73,41 72.75,41.25 67,41.25 66.75,41 66.75,38.25 66.25,38.25 R11.1 | R13.1 16.25,42 16.25,43 17,43 17.25,43.25 23.5,43.25 24.75,42 C9.1 25,42 25.75,42.75 38.25,42.75 40,41 | 44.5,40 44.5,40.75 GPIO13.GND 44.25,41 40,41 | 44.5,40 44.5,32.25 GPIO16.GND | 34.25,40 39,40 40,41 | I2C2.GND 73.25,23 73.25,32 I2C1.GND | U$2.25 63.5,5.5 64.75,4.25 67.25,4.25 68.5,3 U$2.30 68.5,2.75 67.5,1.75 57,1.75 56,2.75 U$2.20
  Bottom 0.152: U$2.39 80,4.25 75,4.25 73.75,3 U$2.34
  other vias: 21.2,23.4 12.2,24.6 5.9,35 27.9,47.47 53.5,46.3 53.7,35.2 53.8,27.3 44.8,16.9 32.9,16.5 33.6,14.3 38.9,18.4 55.1,11.4 39.9,12.2 30.1,8.9 28,5.2 17.9,5.8 87.2,5.3 93.2,2.2 87.9,17.7 83.9,26 98.8,23.1 99.7,44.7 94.9,43 72.2,47.2 69.4,42.3 40.5,36.2 21.7,37.7 16.8,32.1 3.7,34.3 3.6,26 2,6.5 11.4,2.4 9.2,4.3 11.2,4.7 5.5,11 3.6,18.2 30.5,3.7 54.7,17.9 84.1,18.5 78.3,35.8 76,35.7 81.8,44.5 85.1,37.9 88.7,33.9 83,29.5 66.6,26.3 14.2,25.7 10,22.7 1.2,36.8 10.8,43.6 21.6,42.5 29.8,33.2 78.6,17.5 78.5,8.3 89.2,8.2 84.5,3.7 96.8,5.9 99.1,19.1 19.4,31.9 19.1,24.2 21.5,27 8.5,24.8 14.1,17.1 20.4,15.2 21.7,12.5 24.9,12.1 13.7,12.1 13,9.7 63.9,9.5 61.9,9.5 60,9 69.1,9.9 75.7,7.8 74,17.3 61.4,17.8
  pour Top (rank 2): 0,0 0,50.8 101.6,50.8 101.6,0
  pour Bottom (rank 2): 0,0 0,50.8 101.6,50.8 101.6,0
GPIO4  (via drill 0.3)
  Top 0.152: v4,12.5 4.25,12.5 4.25,15.75 3.75,16.25 1.75,16.25 IC2.1
  Bottom 0.152: v4,12.5 4,3.75 4.75,3 4.75,0.5 39.75,0.5 41.75,2.5 41.75,5.5 U$2.7
GPIO5  (via drill 0.3)
  Top 0.152: v22.5,33 17,27.5 12,27.5 6.25,21.75 0.5,21.75 0.5,15.25 0.75,15 1.5,15 IC2.3 | v29,26.5 29,21 v33.5,21 | v58,15 62,11 62.25,11 62.75,10.5 62.75,6.5 62.25,6 62.25,4.25 67.25,4.25 68.5,5.5 U$2.29
  Bottom 0.152: v29,26.5 v22.5,33 | v33.5,21 39.5,15 v58,15
GPIO6  (via drill 0.3)
  Top 0.152: v3.5,14 2,14 1.75,14.25 IC2.4
  Bottom 0.152: v3.5,14 8.5,9 8.5,1 37.75,1 39.25,2.5 39.25,6.5 40,6.5 40.5,7 46,7 46.5,6.5 47.5,6.5 47.75,6.75 58.75,6.75 59.75,5.75 59.75,4.25 61.5,4.25 62.25,5 62.25,6.75 69.75,6.75 71,5.5 U$2.31
GPIO12  (via drill 0.3)
  Top 0.152: v0.75,9.75 0.5,9.75 0.5,13.25 0.75,13.5 1.5,13.5 IC2.5 | v0.75,24.75 14.65,38.65 61.85,38.65 v68.75,31.75
  Bottom 0.152: v0.75,24.75 v0.75,9.75 | v68.75,31.75 68.75,30 69.25,29.5 69.25,11.25 62,11.25 61.25,10.5 61.25,8.5 69.75,8.5 72.25,6 72.25,3 71.25,3 U$2.32
GPIO13  (via drill 0.3)
  Top 0.152: v7.25,21.75 6.75,21.25 4.5,21.25 4.5,20.25 4.75,20 4.75,12.25 4.25,11.75 3.75,11.75 2.75,12.75 2,12.75 1.75,13 IC2.6 | v15.5,14.5 16,14 27.5,14 34.75,21.25 41.25,21.25 45.5,25.5 v51,25.5 | v61.25,15.25 62.25,14.25 64,14.25 65.75,12.5 v65.75,10
  Bottom 0.152: v7.25,21.75 7.25,20.25 7,20 7,14.5 v15.5,14.5 | v61.25,15.25 v51,25.5 | v65.75,10 66.75,9 70,9 73.5,5.5 U$2.33
GPIO16  (via drill 0.3)
  Top 0.152: v9.25,8 7,8 3,12 2,12 1.75,12.25 IC2.7 | v32.25,7 32.5,7.25 v39.75,7.25 | v68.25,7.5 69.75,6 69.75,4.25 74.75,4.25 76,3 U$2.36
  Bottom 0.152: v9.25,8 14.25,3 21.25,3 22,2.25 27.5,2.25 v32.25,7 | v39.75,7.25 40.5,8 67.75,8 v68.25,7.5
H_SCL  (via drill 0.3)
  Top 0.152: 85.75,40.75 85.75,40.5 85.5,40.25 85.5,39.5 IC1.6 | 85.75,40.75 85.75,42.25 R8.1 | v85.25,40.75 85.75,40.75 | I2C2.SCL 79.25,23 79.25,32 I2C1.SCL
  Bottom 0.152: 79.25,40.75 v85.25,40.75 | 79.25,40.75 79.25,32.25 I2C1.SCL | 79.25,40.75 I2C0.SCL
H_SDA
  Top 0.152: IC1.5 86,39.5 86.75,39.5 86.75,42.5 86.25,43 86,43 R8.2 85.75,43.25 85,44 85,45.5 81.75,45.5 77.25,41 I2C0.SDA
  Bottom 0.152: I2C2.SDA 77.25,23 77.25,32 I2C1.SDA 77.25,32.25 77.25,40.75 I2C0.SDA
MISO  (via drill 0.3)
  Top 0.152: v8.75,11.5 12.5,11.5 12.5,12.5 12.25,12.75 12,12.75 11.5,13.25 IC3.12 | v10,10.25 10,0.5 55,0.5 57.25,2.75 57.25,5.5 U$2.21
  Bottom 0.152: v10,10.25 v8.75,11.5
MOSI  (via drill 0.3)
  Top 0.152: v10.25,15.25 10.75,15.25 11.25,14.75 IC3.11 | v15.25,8.25 15.25,1 43,1 44.5,2.5 v44.5,3.75
  Bottom 0.152: v10.25,15.25 17.25,15.25 19,13.5 19,11.5 18.5,11.5 v15.25,8.25 | v44.5,3.75 45,4.25 54.5,4.25 55.75,5.5 U$2.19
N$2  (via drill 0.3)
  Top 0.152: v99.25,38.75 99,38.75 98.5,38.25 R3.1 | v92.25,41 92.25,40.25 U$9.6
  Bottom 0.152: v99.25,38.75 99.25,41 v92.25,41
N$3  (via drill 0.3)
  Top 0.152: v98.5,39.25 97.75,38.5 97.75,38.25 R3.2 | v92.75,39.25 92.75,40 U$9.7
  Bottom 0.152: v98.5,39.25 97.75,40 93.5,40 v92.75,39.25
N$4
  Top 0.152: R1.7 88.75,38.25 88.75,40 89,40 U$9.1
N$5  (via drill 0.3)
  Top 0.152: v96,39 96.75,38.25 R3.3 | v89.5,41 90.25,41.75 92.5,41.75 93.5,40.75 93.5,40.25 U$9.8
  Bottom 0.152: v96,39 95,38 92.5,38 v89.5,41
N$6
  Top 0.152: R3.4 95.75,38.25 94.25,39.75 94.25,40 U$9.9
N$7  (via drill 0.3)
  Top 0.152: v93.75,39 93.5,39 93.5,38.25 R2.6 | v91.75,44.5 91.75,45.25 92.25,45.75 92.25,46 U$9.23
  Bottom 0.152: v93.75,39 93.25,38.5 92.5,38.5 91.5,39.5 91.5,44.5 v91.75,44.5
N$8  (via drill 0.3)
  Top 0.152: v88.25,41.75 88,41.75 88,38.25 R1.8 | v91,45 91,46 U$9.25
  Bottom 0.152: v88.25,41.75 91,44.5 v91,45
N$9  (via drill 0.3)
  Top 0.152: v23,21.5 22,20.5 7,20.5 7,16.25 IC2.20 | v26.5,24.5 26.5,36 v27.75,36
  Bottom 0.152: v23,21.5 23.75,22.25 24.25,22.25 v26.5,24.5 | v27.75,36 33.75,42 37,42 38,41 GPIO4.I/O
N$10
  Top 0.152: R1.6 89.5,38.25 89.5,40 U$9.2
N$11
  Top 0.152: R1.5 90.25,38.25 90.25,40 U$9.3
N$12
  Top 0.152: R2.8 91.75,38.25 91.75,38.75 91,39.5 91,40 U$9.4
N$13
  Top 0.152: R2.7 92.5,38.25 92.5,38.5 91.5,39.5 91.5,40 U$9.5
N$14  (via drill 0.3)
  Top 0.152: v9.25,32.25 v11.75,34.75
  Bottom 0.152: v11.75,34.75 11,35.5 C5.2 | v9.25,32.25 9.25,31.25 9.5,31 9.5,30.25 U1.27
N$15  (via drill 0.3)
  Top 0.152: v5.25,20.5 5.25,16.25 6.5,15 7,15 IC2.18 | v5.25,22.5 10.75,28 14,28 24.25,38.25 32,38.25 38,32.25 GPIO5.I/O
  Bottom 0.152: v5.25,22.5 v5.25,20.5
N$16  (via drill 0.3)
  Top 0.152: v10,31.5 v11.5,33
  Bottom 0.152: v11.5,33 11,33 11,34 C5.1 | v10,31.5 10,30.25 U1.26
N$17  (via drill 0.3)
  Top 0.152: v24,21.5 24.25,21.5 24.25,18.25 24,18 9,18 9,15.25 8.25,14.5 7.5,14.5 7.25,14.25 IC2.17 | v32,21.75 37,21.75 38,22.75 GPIO6.I/O
  Bottom 0.152: v24,21.5 24.25,21.75 v32,21.75
N$18  (via drill 0.3)
  Top 0.152: v9,13.5 7.25,13.5 IC2.16 | v18.25,13.25 18.5,13.5 27.5,13.5 34.75,20.75 46.25,20.75 GPIO12.I/O
  Bottom 0.152: v9,13.5 9.25,13.25 v18.25,13.25
N$19
  Bottom 0.152: C4.1 8.25,34 8.25,31.75 9,31 9,30.25 U1.28
N$20  (via drill 0.3)
  Top 0.152: v5.5,13 7,13 IC2.15
  Bottom 0.152: v5.5,13 3.75,14.75 3.25,14.75 2.75,15.25 2.75,42.5 15.25,42.5 16.5,43.75 45.5,43.75 48.25,41 GPIO13.I/O
N$21
  Bottom 0.152: C4.2 8,35.5 7.25,34.75 7.25,31.25 8.25,31.25 8.5,31 8.5,30.25 U1.29
N$22  (via drill 0.3)
  Top 0.152: v10,17 10.5,16.5 12.5,16.5 12.5,14.25 12.25,14 10.5,14 9,12.5 7.5,12.5 7.25,12.25 IC2.14
  Bottom 0.152: v10,17 11,18 29.25,18 33,21.75 33,24.75 38.5,24.75 44.75,31 47.25,31 48.25,32 GPIO16.I/O
N$23  (via drill 0.3)
  Top 0.152: v22.5,34.75 22.5,33.75 22.75,33.75 23.25,33.25 23.25,29.5 21.5,29.5 v20.75,28.75
  Bottom 0.152: v22.5,34.75 23.25,34.75 23.5,35 25.75,35 26.5,35.75 R5.2 | v20.75,28.75 20.75,29 20.5,29.25 20.5,30 U1.5
N$24
  Bottom 0.152: C1.2 21.25,35.75 20.5,35 20.5,31.25 20.75,31.25 21,31 21,30.25 U1.4
N$25  (via drill 0.3)
  Top 0.152: v23,35.5 23.75,34.75 23.75,28.75 v21.75,28.75
  Bottom 0.152: v23,35.5 23.5,35.5 23.75,35.75 C2.2 | v21.75,28.75 21.75,29 21.5,29.25 21.5,30 U1.3
N$26  (via drill 0.3)
  Top 0.152: v13,32.25 v13,28.75
  Bottom 0.152: R6.1 8.25,37.5 10,35.75 10,32.25 v13,32.25 13.25,32.25 14.5,31 14.5,30.25 U1.17 | v13,28.75 13,30 U1.20
N$27
  Bottom 0.152: 6.25,40.25 7,39.5 8,39.5 R6.2 8.25,39.25 9,39.25 R7.1 | 6.25,40.25 6,40.5 D1.ANODE | 6.25,40.25 14.25,40.25 18.5,36 C3.2
N$28  (via drill 0.3)
  Top 0.152: v1.75,9.75 1.75,10.25 IC2.10 | v2,22.5 17,37.5 v18.5,37.5
  Bottom 0.152: R13.2 18,41.75 20.25,39.5 R16.1 20.25,39.25 v18.5,37.5 | v1.75,9.75 1.75,22.5 v2,22.5
N$29  (via drill 0.3)
  Top 0.152: v31.5,42 28,42 C11.2 | v26,37.5 24,37.5 24,36.5 24.25,36.25 24.25,28.75 23.5,28 19.25,28 12.25,21 7,21 6.75,20.75 6,20.75 6,16 6.25,15.75 6.75,15.75 7,15.5 IC2.19
  Bottom 0.152: v31.5,42 31,41.5 30.5,41.5 SJ3.2 30.25,41.5 30,41.5 v26,37.5
N$30
  Bottom 0.152: SERIAL.VCC 94.5,15.25 69.75,15.25 69.75,35.5 SJ1.2
N$31  (via drill 0.3)
  Top 0.152: v37.25,15.5 31,15.5 27,11.5 17.5,11.5 17,11 IC3.3
  Bottom 0.152: R17.2 67.75,22.75 67.75,20.75 R14.2 67.5,20.5 61.25,14.25 38.5,14.25 v37.25,15.5
N$32  (via drill 0.3)
  Top 0.152: v93.75,47 92.25,47 91.5,46.25 U$9.24
  Bottom 0.152: v93.75,47 100,40.75 100,35 99.25,34.25 99.25,34 SJ2.2
N$33  (via drill 0.3)
  Top 0.152: v84.75,41.5 84.25,41 84.25,39.5 | 84.25,39.5 84.75,39.5 IC1.7 | 84.25,39.5 IC1.8
  Bottom 0.152: v84.75,41.5 84.75,43.25 R9.1
N$34  (via drill 0.3)
  Top 0.152: v19,8.25 17,8.25 IC3.1 | v27.25,12.75 34.75,20.25 54.5,20.25 63,28.75 v66.25,28.75
  Bottom 0.152: R4.2 67.75,40.25 67.75,38.25 R11.2 67.5,38 66.75,37.25 66.75,29.25 v66.25,28.75 | v19,8.25 23.5,12.75 v27.25,12.75
N$35  (via drill 0.3)
  Top 0.152: v91.25,37.25 93.5,37.25 94.25,38 R2.5
  Bottom 0.152: v91.25,37.25 91.25,33.75 89.75,32.25 89.75,22.25 96.25,22.25 98.5,24.5 98.5,33.75 SJ2.1
N$36  (via drill 0.3)
  Top 0.152: v21.5,9.75 17,9.75 IC3.2 | v28.75,11.25 30.75,13.25 44,13.25 50,19.25 65.75,19.25 v68.5,22
  Bottom 0.152: R12.2 67.75,31.75 67.75,30 R10.2 67.75,29.75 68.5,29.75 v68.5,22 | v21.5,9.75 23,11.25 v28.75,11.25
N$37  (via drill 0.3)
  Top 0.152: IC3.15 11.5,9.5 11.5,8.5 IC3.16 11.5,8.25 13,6.75 v13.5,6.75 | v24.75,36.75 24.75,15.25 v23.25,15.25
  Bottom 0.152: v24.75,36.75 24.75,40 C9.2 | v23.25,15.25 14.5,6.5 14,6.5 | 14,6.5 14,5.75 SJ4.2 | v13.5,6.75 13.75,6.5 14,6.5
N$38
  Top 0.152: U$8.7 68.5,14.75 73.25,14.75 74,14 R15.2 74.25,14 84.25,14 84.5,14.25 CAN.CAN_H
N$39
  Top 0.152: U$8.6 68.5,13.75 72.25,13.75 R15.1 73.75,12.5 84.5,12.5 CAN.CAN_L
N$40
  Top 0.152: R18.1 70.25,13 67.75,13 67.25,13.5 67.25,16 68.5,16 U$8.8
PWM0
  Top 0.152: R3.8 98.25,36.25 95.5,33.5 92.75,33.5 91.5,32.25 91.5,31.75 PWM0.I/O
PWM1
  Top 0.152: R3.7 97.5,36.25 95.25,34 92,34 90.25,32.25 90.25,29.25 91.25,29.25 PWM1.I/O
PWM2  (via drill 0.3)
  Top 0.152: v92.75,34.75 95.25,34.75 96.75,36.25 R3.6
  Bottom 0.152: v92.75,34.75 90.25,32.25 90.25,26.75 91.25,26.75 PWM2.I/O
PWM3  (via drill 0.3)
  Top 0.152: v96.5,37.25 96,37.25 96,36.5 R3.5
  Bottom 0.152: v96.5,37.25 96.5,33 97,33 97.75,32.25 97.75,25.5 92.75,25.5 91.5,24.25 PWM3.I/O
RX
  Bottom 0.152: SERIAL.RX 95.5,10 86.75,1.25 44.75,1.25 43.25,2.75 U$2.10
SCL  (via drill 0.3)
  Top 0.152: 87.25,42.75 86.25,43.75 86,43.75 R8.3 | 87.25,42.75 87.25,37.75 86.5,37.75 85.5,36.75 85.5,36.25 IC1.3 | v90,44.5 90.25,44.5 90.25,46 U$9.26 | 87.25,42.75 v87.5,43 | v30.25,20 30.5,19.75 v32,19.75 | v70.5,21.75 65.25,16.5 v64.5,16.5
  Bottom 0.152: v90,44.5 88.5,43 v87.5,43 87.5,21.75 v70.5,21.75 | v30.25,20 25.25,20 25,20.25 16.5,20.25 16.5,30 U1.13 | v32,19.75 37.5,14.25 37.5,13.75 | 37.5,13.75 37.5,5.5 U$2.5 | v64.5,16.5 61.75,13.75 37.5,13.75
SCLK  (via drill 0.3)
  Top 0.152: v10,12.25 11.25,12.25 IC3.13 | v15.5,10.75 16,10.25 21,10.25 21.25,10.5 30,10.5 30.75,9.75 44.25,9.75 v46.75,7.25
  Bottom 0.152: v10,12.25 11.5,10.75 v15.5,10.75 | v46.75,7.25 59,7.25 60.75,5.5 U$2.23
SDA  (via drill 0.3)
  Top 0.152: v87.5,44.75 86,44.75 R8.4 | v89.25,45 89.75,45.5 89.75,46 U$9.27 | v86.75,37 86,36.25 IC1.4 | v29.25,17 v25.5,20.75 | v78,31 77.25,30.25 v37,30.25
  Bottom 0.152: v89.25,45 87.75,45 v87.5,44.75 86.75,44.75 v86.75,37 80.75,31 v78,31 | U1.12 17,30.25 17.5,30.25 U1.11 17.5,30 17.5,25.75 | 17.5,25.75 17.5,20.75 v25.5,20.75 | v29.25,17 29.25,14.25 35.5,8 35.5,5.5 U$2.3 | v37,30.25 32.5,25.75 17.5,25.75
TX  (via drill 0.3)
  Top 0.152: v42,1.75 41,2.75 40.75,2.75 U$2.8
  Bottom 0.152: SERIAL.TX 96.75,11 96.75,9.5 88,0.75 43,0.75 v42,1.75

### Text on the board
tPlace: #523 | Designed in Aizu | Jetson Jetbook | Rev.1.0.2 | GND | VCC | SDA | SCL | GND | VCC | TX | RX